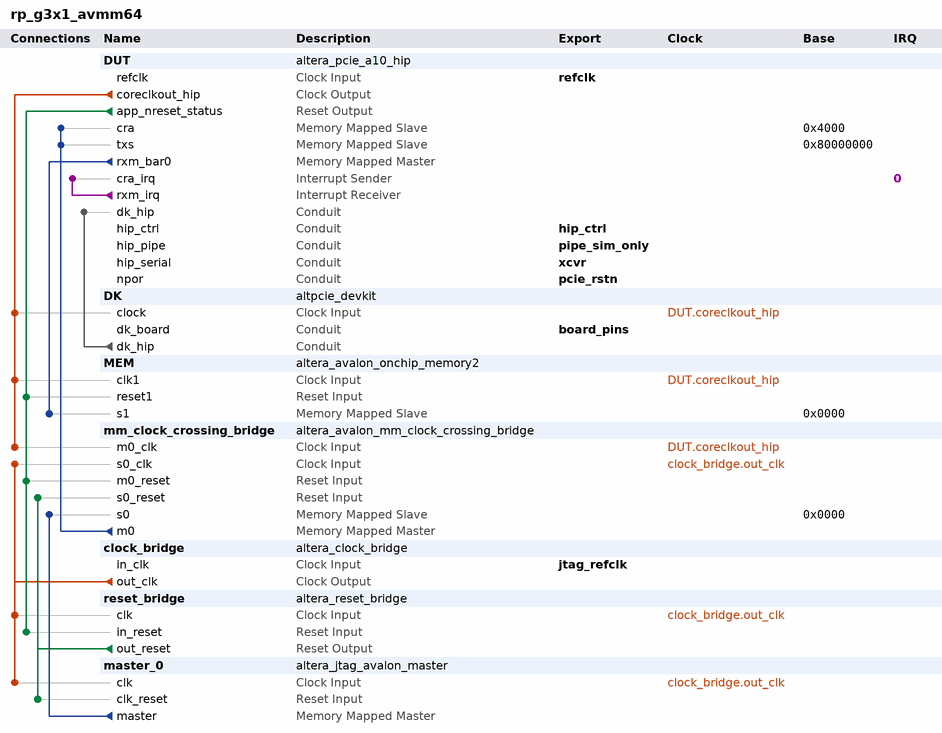
[diagram p0: system contents]
# Platform Designer (Qsys) system rp_g3x1_avmm64, Arria 10 10AX115S1F45I1SG
# Parameters at their usual value, and those the tool derives, are not listed.
package require -exact qsys 18.0
create_system rp_g3x1_avmm64
set_project_property DEVICE_FAMILY {Arria 10}
set_project_property DEVICE 10AX115S1F45I1SG

add_instance DUT altera_pcie_a10_hip 18.0
set_instance_parameter_value DUT adme_enable_hwtcl 0
set_instance_parameter_value DUT advance_error_reporting_hwtcl 0
set_instance_parameter_value DUT apps_type_hwtcl 15
set_instance_parameter_value DUT ari_support_hwtcl 0
set_instance_parameter_value DUT ast_trs_num_desc_hwtcl 16
set_instance_parameter_value DUT ast_trs_rxdata_width_hwtcl 256
set_instance_parameter_value DUT ast_trs_rxdesc_width_hwtcl 256
set_instance_parameter_value DUT ast_trs_rxmty_width_hwtcl 32
set_instance_parameter_value DUT ast_trs_txdata_width_hwtcl 256
set_instance_parameter_value DUT ast_trs_txdesc_width_hwtcl 256
set_instance_parameter_value DUT ast_trs_txmty_width_hwtcl 32
set_instance_parameter_value DUT ast_trs_txstatus_width_hwtcl 256
set_instance_parameter_value DUT avmm_addr_width_hwtcl 32
set_instance_parameter_value DUT bar0_address_width_hwtcl 16
set_instance_parameter_value DUT bar0_type_hwtcl {64-bit prefetchable memory}
set_instance_parameter_value DUT bar1_address_width_hwtcl 0
set_instance_parameter_value DUT bar1_type_hwtcl Disabled
set_instance_parameter_value DUT bar2_address_width_hwtcl 8
set_instance_parameter_value DUT bar2_type_hwtcl Disabled
set_instance_parameter_value DUT bar3_address_width_hwtcl 0
set_instance_parameter_value DUT bar3_type_hwtcl Disabled
set_instance_parameter_value DUT base_device NIGHTFURY5
set_instance_parameter_value DUT bfm_drive_interface_clk_hwtcl 1
set_instance_parameter_value DUT bfm_drive_interface_control_hwtcl 1
set_instance_parameter_value DUT bfm_drive_interface_npor_hwtcl 1
set_instance_parameter_value DUT bfm_drive_interface_pipe_hwtcl 1
set_instance_parameter_value DUT cg_a2p_addr_map_pass_thru_bits_hwtcl 24
set_instance_parameter_value DUT cg_enable_a2p_interrupt_hwtcl 0
set_instance_parameter_value DUT cg_enable_advanced_interrupt_hwtcl 0
set_instance_parameter_value DUT class_code_hwtcl 0
set_instance_parameter_value DUT completion_timeout_hwtcl NONE
set_instance_parameter_value DUT cseb_autonomous_hwtcl 0
set_instance_parameter_value DUT cseb_config_bypass_gui_hwtcl 0
set_instance_parameter_value DUT design_environment_hwtcl QSYS
set_instance_parameter_value DUT devhide_support_hwtcl 0
set_instance_parameter_value DUT device_embedded_ep_support_hwtcl 0
set_instance_parameter_value DUT device_id_hwtcl 57345
set_instance_parameter_value DUT dis_adapt 0
set_instance_parameter_value DUT dma_use_scfifo_ext_hwtcl 0
set_instance_parameter_value DUT ecrc_check_capable_hwtcl 0
set_instance_parameter_value DUT ecrc_gen_capable_hwtcl 0
set_instance_parameter_value DUT enable_alternate_link_list_hwtcl 0
set_instance_parameter_value DUT enable_ast_trs_hwtcl 0
set_instance_parameter_value DUT enable_avst_reset_hwtcl 0
set_instance_parameter_value DUT enable_custom_features_hwtcl 0
set_instance_parameter_value DUT enable_devkit_conduit_hwtcl 1
set_instance_parameter_value DUT enable_example_design_qii_hwtcl 1
set_instance_parameter_value DUT enable_example_design_sim_hwtcl 0
set_instance_parameter_value DUT enable_example_design_synth_hwtcl 0
set_instance_parameter_value DUT enable_example_design_tb_hwtcl 1
set_instance_parameter_value DUT enable_g3_bypass_equlz_rp_sim_hwtcl 1
set_instance_parameter_value DUT enable_gen3phase2eq_timechange 0
set_instance_parameter_value DUT enable_hip_status_for_avmm_hwtcl 0
set_instance_parameter_value DUT enable_lmi_hwtcl 0
set_instance_parameter_value DUT enable_nobar_slection_hwtcl 0
set_instance_parameter_value DUT enable_rxm_burst_hwtcl 0
set_instance_parameter_value DUT enable_skp_det 0
set_instance_parameter_value DUT enable_soft_dfe 0
set_instance_parameter_value DUT export_fpll_output_to_top_level_hwtcl 0
set_instance_parameter_value DUT export_phy_input_to_top_level_hwtcl 0
set_instance_parameter_value DUT extended_tag_support_hwtcl 0
set_instance_parameter_value DUT flr_capability_user_hwtcl 0
set_instance_parameter_value DUT force_tag_checking_on_hwtcl 0
set_instance_parameter_value DUT gen3_coeff_1_hwtcl 9
set_instance_parameter_value DUT gen3_coeff_3_ber_meas_hwtcl 12ms
set_instance_parameter_value DUT include_virtio_capabilities_hwtcl 0
set_instance_parameter_value DUT interface_type_hwtcl Avalon-MM
set_instance_parameter_value DUT internal_controller_hwtcl 1
set_instance_parameter_value DUT link2csr_width_hwtcl 16
set_instance_parameter_value DUT maximum_payload_size_hwtcl 256
set_instance_parameter_value DUT part_trait_device 10AX115S1F45I1SG
set_instance_parameter_value DUT pf0_ats_invalidate_queue_depth_hwtcl 0
set_instance_parameter_value DUT pf0_bar0_prefetchable_hwtcl 1
set_instance_parameter_value DUT pf0_bar0_present_hwtcl 1
set_instance_parameter_value DUT pf0_bar0_size_hwtcl 12
set_instance_parameter_value DUT pf0_bar0_type_hwtcl 1
set_instance_parameter_value DUT pf0_bar1_prefetchable_hwtcl 1
set_instance_parameter_value DUT pf0_bar1_present_hwtcl 0
set_instance_parameter_value DUT pf0_bar1_size_hwtcl 12
set_instance_parameter_value DUT pf0_bar2_prefetchable_hwtcl 1
set_instance_parameter_value DUT pf0_bar2_present_hwtcl 0
set_instance_parameter_value DUT pf0_bar2_size_hwtcl 12
set_instance_parameter_value DUT pf0_bar2_type_hwtcl 1
set_instance_parameter_value DUT pf0_bar3_prefetchable_hwtcl 1
set_instance_parameter_value DUT pf0_bar3_present_hwtcl 0
set_instance_parameter_value DUT pf0_bar3_size_hwtcl 12
set_instance_parameter_value DUT pf0_bar4_prefetchable_hwtcl 1
set_instance_parameter_value DUT pf0_bar4_present_hwtcl 0
set_instance_parameter_value DUT pf0_bar4_size_hwtcl 12
set_instance_parameter_value DUT pf0_bar4_type_hwtcl 1
set_instance_parameter_value DUT pf0_bar5_prefetchable_hwtcl 1
set_instance_parameter_value DUT pf0_bar5_present_hwtcl 0
set_instance_parameter_value DUT pf0_bar5_size_hwtcl 12
set_instance_parameter_value DUT pf0_exprom_bar_present_hwtcl 0
set_instance_parameter_value DUT pf0_exprom_bar_size_hwtcl 12
set_instance_parameter_value DUT pf0_extra_bar_present_hwtcl 0
set_instance_parameter_value DUT pf0_extra_bar_size_hwtcl 12
set_instance_parameter_value DUT pf0_interrupt_pin_hwtcl inta
set_instance_parameter_value DUT pf0_intr_line_hwtcl 0
set_instance_parameter_value DUT pf0_msi_multi_message_capable_hwtcl 4
set_instance_parameter_value DUT pf0_msix_pba_bir_hwtcl 0
set_instance_parameter_value DUT pf0_msix_pba_offset_hwtcl 0
set_instance_parameter_value DUT pf0_msix_table_bir_hwtcl 0
set_instance_parameter_value DUT pf0_msix_table_offset_hwtcl 0
set_instance_parameter_value DUT pf0_msix_table_size_hwtcl 0
set_instance_parameter_value DUT pf0_pci_prog_intfc_byte_hwtcl 0
set_instance_parameter_value DUT pf0_subclass_code_hwtcl 0
set_instance_parameter_value DUT pf0_tph_dev_specific_mode_support_hwtcl 0
set_instance_parameter_value DUT pf0_tph_int_mode_support_hwtcl 0
set_instance_parameter_value DUT pf0_tph_st_table_location_hwtcl 0
set_instance_parameter_value DUT pf0_tph_st_table_size_hwtcl 63
set_instance_parameter_value DUT pf0_vf_bar0_prefetchable_hwtcl 1
set_instance_parameter_value DUT pf0_vf_bar0_present_hwtcl 0
set_instance_parameter_value DUT pf0_vf_bar0_size_hwtcl 12
set_instance_parameter_value DUT pf0_vf_bar0_type_hwtcl 1
set_instance_parameter_value DUT pf0_vf_bar1_prefetchable_hwtcl 1
set_instance_parameter_value DUT pf0_vf_bar1_present_hwtcl 0
set_instance_parameter_value DUT pf0_vf_bar1_size_hwtcl 12
set_instance_parameter_value DUT pf0_vf_bar2_prefetchable_hwtcl 1
set_instance_parameter_value DUT pf0_vf_bar2_present_hwtcl 0
set_instance_parameter_value DUT pf0_vf_bar2_size_hwtcl 12
set_instance_parameter_value DUT pf0_vf_bar2_type_hwtcl 1
set_instance_parameter_value DUT pf0_vf_bar3_prefetchable_hwtcl 1
set_instance_parameter_value DUT pf0_vf_bar3_present_hwtcl 0
set_instance_parameter_value DUT pf0_vf_bar3_size_hwtcl 12
set_instance_parameter_value DUT pf0_vf_bar4_prefetchable_hwtcl 1
set_instance_parameter_value DUT pf0_vf_bar4_present_hwtcl 0
set_instance_parameter_value DUT pf0_vf_bar4_size_hwtcl 12
set_instance_parameter_value DUT pf0_vf_bar4_type_hwtcl 1
set_instance_parameter_value DUT pf0_vf_bar5_prefetchable_hwtcl 1
set_instance_parameter_value DUT pf0_vf_bar5_present_hwtcl 0
set_instance_parameter_value DUT pf0_vf_bar5_size_hwtcl 12
set_instance_parameter_value DUT pf0_vf_count_user_hwtcl 0
set_instance_parameter_value DUT pf0_vf_device_id_hwtcl 0
set_instance_parameter_value DUT pf0_vf_msix_pba_bir_hwtcl 0
set_instance_parameter_value DUT pf0_vf_msix_pba_offset_hwtcl 0
set_instance_parameter_value DUT pf0_vf_msix_tbl_bir_hwtcl 0
set_instance_parameter_value DUT pf0_vf_msix_tbl_offset_hwtcl 0
set_instance_parameter_value DUT pf0_vf_msix_tbl_size_hwtcl 0
set_instance_parameter_value DUT pf0_vf_tph_dev_specific_mode_support_hwtcl 0
set_instance_parameter_value DUT pf0_vf_tph_int_mode_support_hwtcl 0
set_instance_parameter_value DUT pf0_vf_tph_st_table_location_hwtcl 0
set_instance_parameter_value DUT pf0_vf_tph_st_table_size_hwtcl 63
set_instance_parameter_value DUT pf0_virtio_capability_present_hwtcl 0
set_instance_parameter_value DUT pf0_virtio_cmn_config_bar_indicator_hwtcl 0
set_instance_parameter_value DUT pf0_virtio_cmn_config_bar_offset_hwtcl 0
set_instance_parameter_value DUT pf0_virtio_cmn_config_structure_length_hwtcl 0
set_instance_parameter_value DUT pf0_virtio_device_specific_cap_present_hwtcl 0
set_instance_parameter_value DUT pf0_virtio_devspecific_bar_indicator_hwtcl 0
set_instance_parameter_value DUT pf0_virtio_devspecific_bar_offset_hwtcl 0
set_instance_parameter_value DUT pf0_virtio_devspecific_structure_length_hwtcl 0
set_instance_parameter_value DUT pf0_virtio_isrstatus_bar_indicator_hwtcl 0
set_instance_parameter_value DUT pf0_virtio_isrstatus_bar_offset_hwtcl 0
set_instance_parameter_value DUT pf0_virtio_isrstatus_structure_length_hwtcl 0
set_instance_parameter_value DUT pf0_virtio_notification_bar_indicator_hwtcl 0
set_instance_parameter_value DUT pf0_virtio_notification_bar_offset_hwtcl 0
set_instance_parameter_value DUT pf0_virtio_notification_structure_length_hwtcl 0
set_instance_parameter_value DUT pf0_virtio_notify_off_multiplier_hwtcl 0
set_instance_parameter_value DUT pf0_virtio_pciconfig_access_bar_indicator_hwtcl 0
set_instance_parameter_value DUT pf0_virtio_pciconfig_access_bar_offset_hwtcl 0
set_instance_parameter_value DUT pf0_virtio_pciconfig_access_structure_length_hwtcl 0
set_instance_parameter_value DUT pf1_ats_invalidate_queue_depth_hwtcl 0
set_instance_parameter_value DUT pf1_bar0_prefetchable_hwtcl 1
set_instance_parameter_value DUT pf1_bar0_present_hwtcl 0
set_instance_parameter_value DUT pf1_bar0_size_hwtcl 12
set_instance_parameter_value DUT pf1_bar0_type_hwtcl 1
set_instance_parameter_value DUT pf1_bar1_prefetchable_hwtcl 1
set_instance_parameter_value DUT pf1_bar1_present_hwtcl 0
set_instance_parameter_value DUT pf1_bar1_size_hwtcl 12
set_instance_parameter_value DUT pf1_bar2_prefetchable_hwtcl 1
set_instance_parameter_value DUT pf1_bar2_present_hwtcl 0
set_instance_parameter_value DUT pf1_bar2_size_hwtcl 12
set_instance_parameter_value DUT pf1_bar2_type_hwtcl 1
set_instance_parameter_value DUT pf1_bar3_prefetchable_hwtcl 1
set_instance_parameter_value DUT pf1_bar3_present_hwtcl 0
set_instance_parameter_value DUT pf1_bar3_size_hwtcl 12
set_instance_parameter_value DUT pf1_bar4_prefetchable_hwtcl 1
set_instance_parameter_value DUT pf1_bar4_present_hwtcl 0
set_instance_parameter_value DUT pf1_bar4_size_hwtcl 12
set_instance_parameter_value DUT pf1_bar4_type_hwtcl 1
set_instance_parameter_value DUT pf1_bar5_prefetchable_hwtcl 1
set_instance_parameter_value DUT pf1_bar5_present_hwtcl 0
set_instance_parameter_value DUT pf1_bar5_size_hwtcl 12
set_instance_parameter_value DUT pf1_class_code_hwtcl 0
set_instance_parameter_value DUT pf1_device_id_hwtcl 0
set_instance_parameter_value DUT pf1_exprom_bar_present_hwtcl 0
set_instance_parameter_value DUT pf1_exprom_bar_size_hwtcl 12
set_instance_parameter_value DUT pf1_interrupt_pin_hwtcl inta
set_instance_parameter_value DUT pf1_intr_line_hwtcl 0
set_instance_parameter_value DUT pf1_msi_multi_message_capable_hwtcl 4
set_instance_parameter_value DUT pf1_msix_pba_bir_hwtcl 0
set_instance_parameter_value DUT pf1_msix_pba_offset_hwtcl 0
set_instance_parameter_value DUT pf1_msix_table_bir_hwtcl 0
set_instance_parameter_value DUT pf1_msix_table_offset_hwtcl 0
set_instance_parameter_value DUT pf1_msix_table_size_hwtcl 0
set_instance_parameter_value DUT pf1_pci_prog_intfc_byte_hwtcl 0
set_instance_parameter_value DUT pf1_revision_id_hwtcl 0
set_instance_parameter_value DUT pf1_subclass_code_hwtcl 0
set_instance_parameter_value DUT pf1_subsystem_device_id_hwtcl 0
set_instance_parameter_value DUT pf1_subsystem_vendor_id_hwtcl 0
set_instance_parameter_value DUT pf1_tph_dev_specific_mode_support_hwtcl 0
set_instance_parameter_value DUT pf1_tph_int_mode_support_hwtcl 0
set_instance_parameter_value DUT pf1_tph_st_table_location_hwtcl 0
set_instance_parameter_value DUT pf1_tph_st_table_size_hwtcl 63
set_instance_parameter_value DUT pf1_vendor_id_hwtcl 0
set_instance_parameter_value DUT pf1_vf_bar0_prefetchable_hwtcl 1
set_instance_parameter_value DUT pf1_vf_bar0_present_hwtcl 0
set_instance_parameter_value DUT pf1_vf_bar0_size_hwtcl 12
set_instance_parameter_value DUT pf1_vf_bar0_type_hwtcl 1
set_instance_parameter_value DUT pf1_vf_bar1_prefetchable_hwtcl 1
set_instance_parameter_value DUT pf1_vf_bar1_present_hwtcl 0
set_instance_parameter_value DUT pf1_vf_bar1_size_hwtcl 12
set_instance_parameter_value DUT pf1_vf_bar2_prefetchable_hwtcl 1
set_instance_parameter_value DUT pf1_vf_bar2_present_hwtcl 0
set_instance_parameter_value DUT pf1_vf_bar2_size_hwtcl 12
set_instance_parameter_value DUT pf1_vf_bar2_type_hwtcl 1
set_instance_parameter_value DUT pf1_vf_bar3_prefetchable_hwtcl 1
set_instance_parameter_value DUT pf1_vf_bar3_present_hwtcl 0
set_instance_parameter_value DUT pf1_vf_bar3_size_hwtcl 12
set_instance_parameter_value DUT pf1_vf_bar4_prefetchable_hwtcl 1
set_instance_parameter_value DUT pf1_vf_bar4_present_hwtcl 0
set_instance_parameter_value DUT pf1_vf_bar4_size_hwtcl 12
set_instance_parameter_value DUT pf1_vf_bar4_type_hwtcl 1
set_instance_parameter_value DUT pf1_vf_bar5_prefetchable_hwtcl 1
set_instance_parameter_value DUT pf1_vf_bar5_present_hwtcl 0
set_instance_parameter_value DUT pf1_vf_bar5_size_hwtcl 12
set_instance_parameter_value DUT pf1_vf_count_user_hwtcl 0
set_instance_parameter_value DUT pf1_vf_device_id_hwtcl 0
set_instance_parameter_value DUT pf1_vf_msix_pba_bir_hwtcl 0
set_instance_parameter_value DUT pf1_vf_msix_pba_offset_hwtcl 0
set_instance_parameter_value DUT pf1_vf_msix_tbl_bir_hwtcl 0
set_instance_parameter_value DUT pf1_vf_msix_tbl_offset_hwtcl 0
set_instance_parameter_value DUT pf1_vf_msix_tbl_size_hwtcl 0
set_instance_parameter_value DUT pf1_vf_tph_dev_specific_mode_support_hwtcl 0
set_instance_parameter_value DUT pf1_vf_tph_int_mode_support_hwtcl 0
set_instance_parameter_value DUT pf1_vf_tph_st_table_location_hwtcl 0
set_instance_parameter_value DUT pf1_vf_tph_st_table_size_hwtcl 63
set_instance_parameter_value DUT pf1_virtio_capability_present_hwtcl 0
set_instance_parameter_value DUT pf1_virtio_cmn_config_bar_indicator_hwtcl 0
set_instance_parameter_value DUT pf1_virtio_cmn_config_bar_offset_hwtcl 0
set_instance_parameter_value DUT pf1_virtio_cmn_config_structure_length_hwtcl 0
set_instance_parameter_value DUT pf1_virtio_device_specific_cap_present_hwtcl 0
set_instance_parameter_value DUT pf1_virtio_devspecific_bar_indicator_hwtcl 0
set_instance_parameter_value DUT pf1_virtio_devspecific_bar_offset_hwtcl 0
set_instance_parameter_value DUT pf1_virtio_devspecific_structure_length_hwtcl 0
set_instance_parameter_value DUT pf1_virtio_isrstatus_bar_indicator_hwtcl 0
set_instance_parameter_value DUT pf1_virtio_isrstatus_bar_offset_hwtcl 0
set_instance_parameter_value DUT pf1_virtio_isrstatus_structure_length_hwtcl 0
set_instance_parameter_value DUT pf1_virtio_notification_bar_indicator_hwtcl 0
set_instance_parameter_value DUT pf1_virtio_notification_bar_offset_hwtcl 0
set_instance_parameter_value DUT pf1_virtio_notification_structure_length_hwtcl 0
set_instance_parameter_value DUT pf1_virtio_notify_off_multiplier_hwtcl 0
set_instance_parameter_value DUT pf1_virtio_pciconfig_access_bar_indicator_hwtcl 0
set_instance_parameter_value DUT pf1_virtio_pciconfig_access_bar_offset_hwtcl 0
set_instance_parameter_value DUT pf1_virtio_pciconfig_access_structure_length_hwtcl 0
set_instance_parameter_value DUT pf2_ats_invalidate_queue_depth_hwtcl 0
set_instance_parameter_value DUT pf2_bar0_prefetchable_hwtcl 1
set_instance_parameter_value DUT pf2_bar0_present_hwtcl 0
set_instance_parameter_value DUT pf2_bar0_size_hwtcl 12
set_instance_parameter_value DUT pf2_bar0_type_hwtcl 1
set_instance_parameter_value DUT pf2_bar1_prefetchable_hwtcl 1
set_instance_parameter_value DUT pf2_bar1_present_hwtcl 0
set_instance_parameter_value DUT pf2_bar1_size_hwtcl 12
set_instance_parameter_value DUT pf2_bar2_prefetchable_hwtcl 1
set_instance_parameter_value DUT pf2_bar2_present_hwtcl 0
set_instance_parameter_value DUT pf2_bar2_size_hwtcl 12
set_instance_parameter_value DUT pf2_bar2_type_hwtcl 1
set_instance_parameter_value DUT pf2_bar3_prefetchable_hwtcl 1
set_instance_parameter_value DUT pf2_bar3_present_hwtcl 0
set_instance_parameter_value DUT pf2_bar3_size_hwtcl 12
set_instance_parameter_value DUT pf2_bar4_prefetchable_hwtcl 1
set_instance_parameter_value DUT pf2_bar4_present_hwtcl 0
set_instance_parameter_value DUT pf2_bar4_size_hwtcl 12
set_instance_parameter_value DUT pf2_bar4_type_hwtcl 1
set_instance_parameter_value DUT pf2_bar5_prefetchable_hwtcl 1
set_instance_parameter_value DUT pf2_bar5_present_hwtcl 0
set_instance_parameter_value DUT pf2_bar5_size_hwtcl 12
set_instance_parameter_value DUT pf2_class_code_hwtcl 0
set_instance_parameter_value DUT pf2_device_id_hwtcl 0
set_instance_parameter_value DUT pf2_exprom_bar_present_hwtcl 0
set_instance_parameter_value DUT pf2_exprom_bar_size_hwtcl 12
set_instance_parameter_value DUT pf2_interrupt_pin_hwtcl inta
set_instance_parameter_value DUT pf2_intr_line_hwtcl 0
set_instance_parameter_value DUT pf2_msi_multi_message_capable_hwtcl 4
set_instance_parameter_value DUT pf2_msix_pba_bir_hwtcl 0
set_instance_parameter_value DUT pf2_msix_pba_offset_hwtcl 0
set_instance_parameter_value DUT pf2_msix_table_bir_hwtcl 0
set_instance_parameter_value DUT pf2_msix_table_offset_hwtcl 0
set_instance_parameter_value DUT pf2_msix_table_size_hwtcl 0
set_instance_parameter_value DUT pf2_pci_prog_intfc_byte_hwtcl 0
set_instance_parameter_value DUT pf2_revision_id_hwtcl 0
set_instance_parameter_value DUT pf2_subclass_code_hwtcl 0
set_instance_parameter_value DUT pf2_subsystem_device_id_hwtcl 0
set_instance_parameter_value DUT pf2_subsystem_vendor_id_hwtcl 0
set_instance_parameter_value DUT pf2_tph_dev_specific_mode_support_hwtcl 0
set_instance_parameter_value DUT pf2_tph_int_mode_support_hwtcl 0
set_instance_parameter_value DUT pf2_tph_st_table_location_hwtcl 0
set_instance_parameter_value DUT pf2_tph_st_table_size_hwtcl 63
set_instance_parameter_value DUT pf2_vendor_id_hwtcl 0
set_instance_parameter_value DUT pf2_vf_bar0_prefetchable_hwtcl 1
set_instance_parameter_value DUT pf2_vf_bar0_present_hwtcl 0
set_instance_parameter_value DUT pf2_vf_bar0_size_hwtcl 12
set_instance_parameter_value DUT pf2_vf_bar0_type_hwtcl 1
set_instance_parameter_value DUT pf2_vf_bar1_prefetchable_hwtcl 1
set_instance_parameter_value DUT pf2_vf_bar1_present_hwtcl 0
set_instance_parameter_value DUT pf2_vf_bar1_size_hwtcl 12
set_instance_parameter_value DUT pf2_vf_bar2_prefetchable_hwtcl 1
set_instance_parameter_value DUT pf2_vf_bar2_present_hwtcl 0
set_instance_parameter_value DUT pf2_vf_bar2_size_hwtcl 12
set_instance_parameter_value DUT pf2_vf_bar2_type_hwtcl 1
set_instance_parameter_value DUT pf2_vf_bar3_prefetchable_hwtcl 1
set_instance_parameter_value DUT pf2_vf_bar3_present_hwtcl 0
set_instance_parameter_value DUT pf2_vf_bar3_size_hwtcl 12
set_instance_parameter_value DUT pf2_vf_bar4_prefetchable_hwtcl 1
set_instance_parameter_value DUT pf2_vf_bar4_present_hwtcl 0
set_instance_parameter_value DUT pf2_vf_bar4_size_hwtcl 12
set_instance_parameter_value DUT pf2_vf_bar4_type_hwtcl 1
set_instance_parameter_value DUT pf2_vf_bar5_prefetchable_hwtcl 1
set_instance_parameter_value DUT pf2_vf_bar5_present_hwtcl 0
set_instance_parameter_value DUT pf2_vf_bar5_size_hwtcl 12
set_instance_parameter_value DUT pf2_vf_count_user_hwtcl 0
set_instance_parameter_value DUT pf2_vf_device_id_hwtcl 0
set_instance_parameter_value DUT pf2_vf_msix_pba_bir_hwtcl 0
set_instance_parameter_value DUT pf2_vf_msix_pba_offset_hwtcl 0
set_instance_parameter_value DUT pf2_vf_msix_tbl_bir_hwtcl 0
set_instance_parameter_value DUT pf2_vf_msix_tbl_offset_hwtcl 0
set_instance_parameter_value DUT pf2_vf_msix_tbl_size_hwtcl 0
set_instance_parameter_value DUT pf2_vf_tph_dev_specific_mode_support_hwtcl 0
set_instance_parameter_value DUT pf2_vf_tph_int_mode_support_hwtcl 0
set_instance_parameter_value DUT pf2_vf_tph_st_table_location_hwtcl 0
set_instance_parameter_value DUT pf2_vf_tph_st_table_size_hwtcl 63
set_instance_parameter_value DUT pf2_virtio_capability_present_hwtcl 0
set_instance_parameter_value DUT pf2_virtio_cmn_config_bar_indicator_hwtcl 0
set_instance_parameter_value DUT pf2_virtio_cmn_config_bar_offset_hwtcl 0
set_instance_parameter_value DUT pf2_virtio_cmn_config_structure_length_hwtcl 0
set_instance_parameter_value DUT pf2_virtio_device_specific_cap_present_hwtcl 0
set_instance_parameter_value DUT pf2_virtio_devspecific_bar_indicator_hwtcl 0
set_instance_parameter_value DUT pf2_virtio_devspecific_bar_offset_hwtcl 0
set_instance_parameter_value DUT pf2_virtio_devspecific_structure_length_hwtcl 0
set_instance_parameter_value DUT pf2_virtio_isrstatus_bar_indicator_hwtcl 0
set_instance_parameter_value DUT pf2_virtio_isrstatus_bar_offset_hwtcl 0
set_instance_parameter_value DUT pf2_virtio_isrstatus_structure_length_hwtcl 0
set_instance_parameter_value DUT pf2_virtio_notification_bar_indicator_hwtcl 0
set_instance_parameter_value DUT pf2_virtio_notification_bar_offset_hwtcl 0
set_instance_parameter_value DUT pf2_virtio_notification_structure_length_hwtcl 0
set_instance_parameter_value DUT pf2_virtio_notify_off_multiplier_hwtcl 0
set_instance_parameter_value DUT pf2_virtio_pciconfig_access_bar_indicator_hwtcl 0
set_instance_parameter_value DUT pf2_virtio_pciconfig_access_bar_offset_hwtcl 0
set_instance_parameter_value DUT pf2_virtio_pciconfig_access_structure_length_hwtcl 0
set_instance_parameter_value DUT pf3_ats_invalidate_queue_depth_hwtcl 0
set_instance_parameter_value DUT pf3_bar0_prefetchable_hwtcl 1
set_instance_parameter_value DUT pf3_bar0_present_hwtcl 0
set_instance_parameter_value DUT pf3_bar0_size_hwtcl 12
set_instance_parameter_value DUT pf3_bar0_type_hwtcl 1
set_instance_parameter_value DUT pf3_bar1_prefetchable_hwtcl 1
set_instance_parameter_value DUT pf3_bar1_present_hwtcl 0
set_instance_parameter_value DUT pf3_bar1_size_hwtcl 12
set_instance_parameter_value DUT pf3_bar2_prefetchable_hwtcl 1
set_instance_parameter_value DUT pf3_bar2_present_hwtcl 0
set_instance_parameter_value DUT pf3_bar2_size_hwtcl 12
set_instance_parameter_value DUT pf3_bar2_type_hwtcl 1
set_instance_parameter_value DUT pf3_bar3_prefetchable_hwtcl 1
set_instance_parameter_value DUT pf3_bar3_present_hwtcl 0
set_instance_parameter_value DUT pf3_bar3_size_hwtcl 12
set_instance_parameter_value DUT pf3_bar4_prefetchable_hwtcl 1
set_instance_parameter_value DUT pf3_bar4_present_hwtcl 0
set_instance_parameter_value DUT pf3_bar4_size_hwtcl 12
set_instance_parameter_value DUT pf3_bar4_type_hwtcl 1
set_instance_parameter_value DUT pf3_bar5_prefetchable_hwtcl 1
set_instance_parameter_value DUT pf3_bar5_present_hwtcl 0
set_instance_parameter_value DUT pf3_bar5_size_hwtcl 12
set_instance_parameter_value DUT pf3_class_code_hwtcl 0
set_instance_parameter_value DUT pf3_device_id_hwtcl 0
set_instance_parameter_value DUT pf3_exprom_bar_present_hwtcl 0
set_instance_parameter_value DUT pf3_exprom_bar_size_hwtcl 12
set_instance_parameter_value DUT pf3_interrupt_pin_hwtcl inta
set_instance_parameter_value DUT pf3_intr_line_hwtcl 0
set_instance_parameter_value DUT pf3_msi_multi_message_capable_hwtcl 4
set_instance_parameter_value DUT pf3_msix_pba_bir_hwtcl 0
set_instance_parameter_value DUT pf3_msix_pba_offset_hwtcl 0
set_instance_parameter_value DUT pf3_msix_table_bir_hwtcl 0
set_instance_parameter_value DUT pf3_msix_table_offset_hwtcl 0
set_instance_parameter_value DUT pf3_msix_table_size_hwtcl 0
set_instance_parameter_value DUT pf3_pci_prog_intfc_byte_hwtcl 0
set_instance_parameter_value DUT pf3_revision_id_hwtcl 0
set_instance_parameter_value DUT pf3_subclass_code_hwtcl 0
set_instance_parameter_value DUT pf3_subsystem_device_id_hwtcl 0
set_instance_parameter_value DUT pf3_subsystem_vendor_id_hwtcl 0
set_instance_parameter_value DUT pf3_tph_dev_specific_mode_support_hwtcl 0
set_instance_parameter_value DUT pf3_tph_int_mode_support_hwtcl 0
set_instance_parameter_value DUT pf3_tph_st_table_location_hwtcl 0
set_instance_parameter_value DUT pf3_tph_st_table_size_hwtcl 63
set_instance_parameter_value DUT pf3_vendor_id_hwtcl 0
set_instance_parameter_value DUT pf3_vf_bar0_prefetchable_hwtcl 1
set_instance_parameter_value DUT pf3_vf_bar0_present_hwtcl 0
set_instance_parameter_value DUT pf3_vf_bar0_size_hwtcl 12
set_instance_parameter_value DUT pf3_vf_bar0_type_hwtcl 1
set_instance_parameter_value DUT pf3_vf_bar1_prefetchable_hwtcl 1
set_instance_parameter_value DUT pf3_vf_bar1_present_hwtcl 0
set_instance_parameter_value DUT pf3_vf_bar1_size_hwtcl 12
set_instance_parameter_value DUT pf3_vf_bar2_prefetchable_hwtcl 1
set_instance_parameter_value DUT pf3_vf_bar2_present_hwtcl 0
set_instance_parameter_value DUT pf3_vf_bar2_size_hwtcl 12
set_instance_parameter_value DUT pf3_vf_bar2_type_hwtcl 1
set_instance_parameter_value DUT pf3_vf_bar3_prefetchable_hwtcl 1
set_instance_parameter_value DUT pf3_vf_bar3_present_hwtcl 0
set_instance_parameter_value DUT pf3_vf_bar3_size_hwtcl 12
set_instance_parameter_value DUT pf3_vf_bar4_prefetchable_hwtcl 1
set_instance_parameter_value DUT pf3_vf_bar4_present_hwtcl 0
set_instance_parameter_value DUT pf3_vf_bar4_size_hwtcl 12
set_instance_parameter_value DUT pf3_vf_bar4_type_hwtcl 1
set_instance_parameter_value DUT pf3_vf_bar5_prefetchable_hwtcl 1
set_instance_parameter_value DUT pf3_vf_bar5_present_hwtcl 0
set_instance_parameter_value DUT pf3_vf_bar5_size_hwtcl 12
set_instance_parameter_value DUT pf3_vf_count_user_hwtcl 0
set_instance_parameter_value DUT pf3_vf_device_id_hwtcl 0
set_instance_parameter_value DUT pf3_vf_msix_pba_bir_hwtcl 0
set_instance_parameter_value DUT pf3_vf_msix_pba_offset_hwtcl 0
set_instance_parameter_value DUT pf3_vf_msix_tbl_bir_hwtcl 0
set_instance_parameter_value DUT pf3_vf_msix_tbl_offset_hwtcl 0
set_instance_parameter_value DUT pf3_vf_msix_tbl_size_hwtcl 0
set_instance_parameter_value DUT pf3_vf_tph_dev_specific_mode_support_hwtcl 0
set_instance_parameter_value DUT pf3_vf_tph_int_mode_support_hwtcl 0
set_instance_parameter_value DUT pf3_vf_tph_st_table_location_hwtcl 0
set_instance_parameter_value DUT pf3_vf_tph_st_table_size_hwtcl 63
set_instance_parameter_value DUT pf3_virtio_capability_present_hwtcl 0
set_instance_parameter_value DUT pf3_virtio_cmn_config_bar_indicator_hwtcl 0
set_instance_parameter_value DUT pf3_virtio_cmn_config_bar_offset_hwtcl 0
set_instance_parameter_value DUT pf3_virtio_cmn_config_structure_length_hwtcl 0
set_instance_parameter_value DUT pf3_virtio_device_specific_cap_present_hwtcl 0
set_instance_parameter_value DUT pf3_virtio_devspecific_bar_indicator_hwtcl 0
set_instance_parameter_value DUT pf3_virtio_devspecific_bar_offset_hwtcl 0
set_instance_parameter_value DUT pf3_virtio_devspecific_structure_length_hwtcl 0
set_instance_parameter_value DUT pf3_virtio_isrstatus_bar_indicator_hwtcl 0
set_instance_parameter_value DUT pf3_virtio_isrstatus_bar_offset_hwtcl 0
set_instance_parameter_value DUT pf3_virtio_isrstatus_structure_length_hwtcl 0
set_instance_parameter_value DUT pf3_virtio_notification_bar_indicator_hwtcl 0
set_instance_parameter_value DUT pf3_virtio_notification_bar_offset_hwtcl 0
set_instance_parameter_value DUT pf3_virtio_notification_structure_length_hwtcl 0
set_instance_parameter_value DUT pf3_virtio_notify_off_multiplier_hwtcl 0
set_instance_parameter_value DUT pf3_virtio_pciconfig_access_bar_indicator_hwtcl 0
set_instance_parameter_value DUT pf3_virtio_pciconfig_access_bar_offset_hwtcl 0
set_instance_parameter_value DUT pf3_virtio_pciconfig_access_structure_length_hwtcl 0
set_instance_parameter_value DUT pf4_bar0_prefetchable_hwtcl 1
set_instance_parameter_value DUT pf4_bar0_present_hwtcl 0
set_instance_parameter_value DUT pf4_bar0_size_hwtcl 12
set_instance_parameter_value DUT pf4_bar0_type_hwtcl 1
set_instance_parameter_value DUT pf4_bar1_prefetchable_hwtcl 1
set_instance_parameter_value DUT pf4_bar1_present_hwtcl 0
set_instance_parameter_value DUT pf4_bar1_size_hwtcl 12
set_instance_parameter_value DUT pf4_bar2_prefetchable_hwtcl 1
set_instance_parameter_value DUT pf4_bar2_present_hwtcl 0
set_instance_parameter_value DUT pf4_bar2_size_hwtcl 12
set_instance_parameter_value DUT pf4_bar2_type_hwtcl 1
set_instance_parameter_value DUT pf4_bar3_prefetchable_hwtcl 1
set_instance_parameter_value DUT pf4_bar3_present_hwtcl 0
set_instance_parameter_value DUT pf4_bar3_size_hwtcl 12
set_instance_parameter_value DUT pf4_bar4_prefetchable_hwtcl 1
set_instance_parameter_value DUT pf4_bar4_present_hwtcl 0
set_instance_parameter_value DUT pf4_bar4_size_hwtcl 12
set_instance_parameter_value DUT pf4_bar4_type_hwtcl 1
set_instance_parameter_value DUT pf4_bar5_prefetchable_hwtcl 1
set_instance_parameter_value DUT pf4_bar5_present_hwtcl 0
set_instance_parameter_value DUT pf4_bar5_size_hwtcl 12
set_instance_parameter_value DUT pf4_class_code_hwtcl 0
set_instance_parameter_value DUT pf4_device_id_hwtcl 0
set_instance_parameter_value DUT pf4_exprom_bar_present_hwtcl 0
set_instance_parameter_value DUT pf4_exprom_bar_size_hwtcl 12
set_instance_parameter_value DUT pf4_interrupt_pin_hwtcl inta
set_instance_parameter_value DUT pf4_intr_line_hwtcl 0
set_instance_parameter_value DUT pf4_msi_multi_message_capable_hwtcl 4
set_instance_parameter_value DUT pf4_msix_pba_bir_hwtcl 0
set_instance_parameter_value DUT pf4_msix_pba_offset_hwtcl 0
set_instance_parameter_value DUT pf4_msix_table_bir_hwtcl 0
set_instance_parameter_value DUT pf4_msix_table_offset_hwtcl 0
set_instance_parameter_value DUT pf4_msix_table_size_hwtcl 0
set_instance_parameter_value DUT pf4_pci_prog_intfc_byte_hwtcl 0
set_instance_parameter_value DUT pf4_revision_id_hwtcl 0
set_instance_parameter_value DUT pf4_subclass_code_hwtcl 0
set_instance_parameter_value DUT pf4_subsystem_device_id_hwtcl 0
set_instance_parameter_value DUT pf4_subsystem_vendor_id_hwtcl 0
set_instance_parameter_value DUT pf4_vendor_id_hwtcl 0
set_instance_parameter_value DUT pf4_vf_device_id_hwtcl 0
set_instance_parameter_value DUT pf4_virtio_capability_present_hwtcl 0
set_instance_parameter_value DUT pf4_virtio_cmn_config_bar_indicator_hwtcl 0
set_instance_parameter_value DUT pf4_virtio_cmn_config_bar_offset_hwtcl 0
set_instance_parameter_value DUT pf4_virtio_cmn_config_structure_length_hwtcl 0
set_instance_parameter_value DUT pf4_virtio_device_specific_cap_present_hwtcl 0
set_instance_parameter_value DUT pf4_virtio_devspecific_bar_indicator_hwtcl 0
set_instance_parameter_value DUT pf4_virtio_devspecific_bar_offset_hwtcl 0
set_instance_parameter_value DUT pf4_virtio_devspecific_structure_length_hwtcl 0
set_instance_parameter_value DUT pf4_virtio_isrstatus_bar_indicator_hwtcl 0
set_instance_parameter_value DUT pf4_virtio_isrstatus_bar_offset_hwtcl 0
set_instance_parameter_value DUT pf4_virtio_isrstatus_structure_length_hwtcl 0
set_instance_parameter_value DUT pf4_virtio_notification_bar_indicator_hwtcl 0
set_instance_parameter_value DUT pf4_virtio_notification_bar_offset_hwtcl 0
set_instance_parameter_value DUT pf4_virtio_notification_structure_length_hwtcl 0
set_instance_parameter_value DUT pf4_virtio_notify_off_multiplier_hwtcl 0
set_instance_parameter_value DUT pf4_virtio_pciconfig_access_bar_indicator_hwtcl 0
set_instance_parameter_value DUT pf4_virtio_pciconfig_access_bar_offset_hwtcl 0
set_instance_parameter_value DUT pf4_virtio_pciconfig_access_structure_length_hwtcl 0
set_instance_parameter_value DUT pf5_bar0_prefetchable_hwtcl 1
set_instance_parameter_value DUT pf5_bar0_present_hwtcl 0
set_instance_parameter_value DUT pf5_bar0_size_hwtcl 12
set_instance_parameter_value DUT pf5_bar0_type_hwtcl 1
set_instance_parameter_value DUT pf5_bar1_prefetchable_hwtcl 1
set_instance_parameter_value DUT pf5_bar1_present_hwtcl 0
set_instance_parameter_value DUT pf5_bar1_size_hwtcl 12
set_instance_parameter_value DUT pf5_bar2_prefetchable_hwtcl 1
set_instance_parameter_value DUT pf5_bar2_present_hwtcl 0
set_instance_parameter_value DUT pf5_bar2_size_hwtcl 12
set_instance_parameter_value DUT pf5_bar2_type_hwtcl 1
set_instance_parameter_value DUT pf5_bar3_prefetchable_hwtcl 1
set_instance_parameter_value DUT pf5_bar3_present_hwtcl 0
set_instance_parameter_value DUT pf5_bar3_size_hwtcl 12
set_instance_parameter_value DUT pf5_bar4_prefetchable_hwtcl 1
set_instance_parameter_value DUT pf5_bar4_present_hwtcl 0
set_instance_parameter_value DUT pf5_bar4_size_hwtcl 12
set_instance_parameter_value DUT pf5_bar4_type_hwtcl 1
set_instance_parameter_value DUT pf5_bar5_prefetchable_hwtcl 1
set_instance_parameter_value DUT pf5_bar5_present_hwtcl 0
set_instance_parameter_value DUT pf5_bar5_size_hwtcl 12
set_instance_parameter_value DUT pf5_class_code_hwtcl 0
set_instance_parameter_value DUT pf5_device_id_hwtcl 0
set_instance_parameter_value DUT pf5_exprom_bar_present_hwtcl 0
set_instance_parameter_value DUT pf5_exprom_bar_size_hwtcl 12
set_instance_parameter_value DUT pf5_interrupt_pin_hwtcl inta
set_instance_parameter_value DUT pf5_intr_line_hwtcl 0
set_instance_parameter_value DUT pf5_msi_multi_message_capable_hwtcl 4
set_instance_parameter_value DUT pf5_msix_pba_bir_hwtcl 0
set_instance_parameter_value DUT pf5_msix_pba_offset_hwtcl 0
set_instance_parameter_value DUT pf5_msix_table_bir_hwtcl 0
set_instance_parameter_value DUT pf5_msix_table_offset_hwtcl 0
set_instance_parameter_value DUT pf5_msix_table_size_hwtcl 0
set_instance_parameter_value DUT pf5_pci_prog_intfc_byte_hwtcl 0
set_instance_parameter_value DUT pf5_revision_id_hwtcl 0
set_instance_parameter_value DUT pf5_subclass_code_hwtcl 0
set_instance_parameter_value DUT pf5_subsystem_device_id_hwtcl 0
set_instance_parameter_value DUT pf5_subsystem_vendor_id_hwtcl 0
set_instance_parameter_value DUT pf5_vendor_id_hwtcl 0
set_instance_parameter_value DUT pf5_vf_device_id_hwtcl 0
set_instance_parameter_value DUT pf5_virtio_capability_present_hwtcl 0
set_instance_parameter_value DUT pf5_virtio_cmn_config_bar_indicator_hwtcl 0
set_instance_parameter_value DUT pf5_virtio_cmn_config_bar_offset_hwtcl 0
set_instance_parameter_value DUT pf5_virtio_cmn_config_structure_length_hwtcl 0
set_instance_parameter_value DUT pf5_virtio_device_specific_cap_present_hwtcl 0
set_instance_parameter_value DUT pf5_virtio_devspecific_bar_indicator_hwtcl 0
set_instance_parameter_value DUT pf5_virtio_devspecific_bar_offset_hwtcl 0
set_instance_parameter_value DUT pf5_virtio_devspecific_structure_length_hwtcl 0
set_instance_parameter_value DUT pf5_virtio_isrstatus_bar_indicator_hwtcl 0
set_instance_parameter_value DUT pf5_virtio_isrstatus_bar_offset_hwtcl 0
set_instance_parameter_value DUT pf5_virtio_isrstatus_structure_length_hwtcl 0
set_instance_parameter_value DUT pf5_virtio_notification_bar_indicator_hwtcl 0
set_instance_parameter_value DUT pf5_virtio_notification_bar_offset_hwtcl 0
set_instance_parameter_value DUT pf5_virtio_notification_structure_length_hwtcl 0
set_instance_parameter_value DUT pf5_virtio_notify_off_multiplier_hwtcl 0
set_instance_parameter_value DUT pf5_virtio_pciconfig_access_bar_indicator_hwtcl 0
set_instance_parameter_value DUT pf5_virtio_pciconfig_access_bar_offset_hwtcl 0
set_instance_parameter_value DUT pf5_virtio_pciconfig_access_structure_length_hwtcl 0
set_instance_parameter_value DUT pf6_bar0_prefetchable_hwtcl 1
set_instance_parameter_value DUT pf6_bar0_present_hwtcl 0
set_instance_parameter_value DUT pf6_bar0_size_hwtcl 12
set_instance_parameter_value DUT pf6_bar0_type_hwtcl 1
set_instance_parameter_value DUT pf6_bar1_prefetchable_hwtcl 1
set_instance_parameter_value DUT pf6_bar1_present_hwtcl 0
set_instance_parameter_value DUT pf6_bar1_size_hwtcl 12
set_instance_parameter_value DUT pf6_bar2_prefetchable_hwtcl 1
set_instance_parameter_value DUT pf6_bar2_present_hwtcl 0
set_instance_parameter_value DUT pf6_bar2_size_hwtcl 12
set_instance_parameter_value DUT pf6_bar2_type_hwtcl 1
set_instance_parameter_value DUT pf6_bar3_prefetchable_hwtcl 1
set_instance_parameter_value DUT pf6_bar3_present_hwtcl 0
set_instance_parameter_value DUT pf6_bar3_size_hwtcl 12
set_instance_parameter_value DUT pf6_bar4_prefetchable_hwtcl 1
set_instance_parameter_value DUT pf6_bar4_present_hwtcl 0
set_instance_parameter_value DUT pf6_bar4_size_hwtcl 12
set_instance_parameter_value DUT pf6_bar4_type_hwtcl 1
set_instance_parameter_value DUT pf6_bar5_prefetchable_hwtcl 1
set_instance_parameter_value DUT pf6_bar5_present_hwtcl 0
set_instance_parameter_value DUT pf6_bar5_size_hwtcl 12
set_instance_parameter_value DUT pf6_class_code_hwtcl 0
set_instance_parameter_value DUT pf6_device_id_hwtcl 0
set_instance_parameter_value DUT pf6_exprom_bar_present_hwtcl 0
set_instance_parameter_value DUT pf6_exprom_bar_size_hwtcl 12
set_instance_parameter_value DUT pf6_interrupt_pin_hwtcl inta
set_instance_parameter_value DUT pf6_intr_line_hwtcl 0
set_instance_parameter_value DUT pf6_msi_multi_message_capable_hwtcl 4
set_instance_parameter_value DUT pf6_msix_pba_bir_hwtcl 0
set_instance_parameter_value DUT pf6_msix_pba_offset_hwtcl 0
set_instance_parameter_value DUT pf6_msix_table_bir_hwtcl 0
set_instance_parameter_value DUT pf6_msix_table_offset_hwtcl 0
set_instance_parameter_value DUT pf6_msix_table_size_hwtcl 0
set_instance_parameter_value DUT pf6_pci_prog_intfc_byte_hwtcl 0
set_instance_parameter_value DUT pf6_revision_id_hwtcl 0
set_instance_parameter_value DUT pf6_subclass_code_hwtcl 0
set_instance_parameter_value DUT pf6_subsystem_device_id_hwtcl 0
set_instance_parameter_value DUT pf6_subsystem_vendor_id_hwtcl 0
set_instance_parameter_value DUT pf6_vendor_id_hwtcl 0
set_instance_parameter_value DUT pf6_vf_device_id_hwtcl 0
set_instance_parameter_value DUT pf6_virtio_capability_present_hwtcl 0
set_instance_parameter_value DUT pf6_virtio_cmn_config_bar_indicator_hwtcl 0
set_instance_parameter_value DUT pf6_virtio_cmn_config_bar_offset_hwtcl 0
set_instance_parameter_value DUT pf6_virtio_cmn_config_structure_length_hwtcl 0
set_instance_parameter_value DUT pf6_virtio_device_specific_cap_present_hwtcl 0
set_instance_parameter_value DUT pf6_virtio_devspecific_bar_indicator_hwtcl 0
set_instance_parameter_value DUT pf6_virtio_devspecific_bar_offset_hwtcl 0
set_instance_parameter_value DUT pf6_virtio_devspecific_structure_length_hwtcl 0
set_instance_parameter_value DUT pf6_virtio_isrstatus_bar_indicator_hwtcl 0
set_instance_parameter_value DUT pf6_virtio_isrstatus_bar_offset_hwtcl 0
set_instance_parameter_value DUT pf6_virtio_isrstatus_structure_length_hwtcl 0
set_instance_parameter_value DUT pf6_virtio_notification_bar_indicator_hwtcl 0
set_instance_parameter_value DUT pf6_virtio_notification_bar_offset_hwtcl 0
set_instance_parameter_value DUT pf6_virtio_notification_structure_length_hwtcl 0
set_instance_parameter_value DUT pf6_virtio_notify_off_multiplier_hwtcl 0
set_instance_parameter_value DUT pf6_virtio_pciconfig_access_bar_indicator_hwtcl 0
set_instance_parameter_value DUT pf6_virtio_pciconfig_access_bar_offset_hwtcl 0
set_instance_parameter_value DUT pf6_virtio_pciconfig_access_structure_length_hwtcl 0
set_instance_parameter_value DUT pf7_bar0_prefetchable_hwtcl 1
set_instance_parameter_value DUT pf7_bar0_present_hwtcl 0
set_instance_parameter_value DUT pf7_bar0_size_hwtcl 12
set_instance_parameter_value DUT pf7_bar0_type_hwtcl 1
set_instance_parameter_value DUT pf7_bar1_prefetchable_hwtcl 1
set_instance_parameter_value DUT pf7_bar1_present_hwtcl 0
set_instance_parameter_value DUT pf7_bar1_size_hwtcl 12
set_instance_parameter_value DUT pf7_bar2_prefetchable_hwtcl 1
set_instance_parameter_value DUT pf7_bar2_present_hwtcl 0
set_instance_parameter_value DUT pf7_bar2_size_hwtcl 12
set_instance_parameter_value DUT pf7_bar2_type_hwtcl 1
set_instance_parameter_value DUT pf7_bar3_prefetchable_hwtcl 1
set_instance_parameter_value DUT pf7_bar3_present_hwtcl 0
set_instance_parameter_value DUT pf7_bar3_size_hwtcl 12
set_instance_parameter_value DUT pf7_bar4_prefetchable_hwtcl 1
set_instance_parameter_value DUT pf7_bar4_present_hwtcl 0
set_instance_parameter_value DUT pf7_bar4_size_hwtcl 12
set_instance_parameter_value DUT pf7_bar4_type_hwtcl 1
set_instance_parameter_value DUT pf7_bar5_prefetchable_hwtcl 1
set_instance_parameter_value DUT pf7_bar5_present_hwtcl 0
set_instance_parameter_value DUT pf7_bar5_size_hwtcl 12
set_instance_parameter_value DUT pf7_class_code_hwtcl 0
set_instance_parameter_value DUT pf7_device_id_hwtcl 0
set_instance_parameter_value DUT pf7_exprom_bar_present_hwtcl 0
set_instance_parameter_value DUT pf7_exprom_bar_size_hwtcl 12
set_instance_parameter_value DUT pf7_interrupt_pin_hwtcl inta
set_instance_parameter_value DUT pf7_intr_line_hwtcl 0
set_instance_parameter_value DUT pf7_msi_multi_message_capable_hwtcl 4
set_instance_parameter_value DUT pf7_msix_pba_bir_hwtcl 0
set_instance_parameter_value DUT pf7_msix_pba_offset_hwtcl 0
set_instance_parameter_value DUT pf7_msix_table_bir_hwtcl 0
set_instance_parameter_value DUT pf7_msix_table_offset_hwtcl 0
set_instance_parameter_value DUT pf7_msix_table_size_hwtcl 0
set_instance_parameter_value DUT pf7_pci_prog_intfc_byte_hwtcl 0
set_instance_parameter_value DUT pf7_revision_id_hwtcl 0
set_instance_parameter_value DUT pf7_subclass_code_hwtcl 0
set_instance_parameter_value DUT pf7_subsystem_device_id_hwtcl 0
set_instance_parameter_value DUT pf7_subsystem_vendor_id_hwtcl 0
set_instance_parameter_value DUT pf7_vendor_id_hwtcl 0
set_instance_parameter_value DUT pf7_vf_device_id_hwtcl 0
set_instance_parameter_value DUT pf7_virtio_capability_present_hwtcl 0
set_instance_parameter_value DUT pf7_virtio_cmn_config_bar_indicator_hwtcl 0
set_instance_parameter_value DUT pf7_virtio_cmn_config_bar_offset_hwtcl 0
set_instance_parameter_value DUT pf7_virtio_cmn_config_structure_length_hwtcl 0
set_instance_parameter_value DUT pf7_virtio_device_specific_cap_present_hwtcl 0
set_instance_parameter_value DUT pf7_virtio_devspecific_bar_indicator_hwtcl 0
set_instance_parameter_value DUT pf7_virtio_devspecific_bar_offset_hwtcl 0
set_instance_parameter_value DUT pf7_virtio_devspecific_structure_length_hwtcl 0
set_instance_parameter_value DUT pf7_virtio_isrstatus_bar_indicator_hwtcl 0
set_instance_parameter_value DUT pf7_virtio_isrstatus_bar_offset_hwtcl 0
set_instance_parameter_value DUT pf7_virtio_isrstatus_structure_length_hwtcl 0
set_instance_parameter_value DUT pf7_virtio_notification_bar_indicator_hwtcl 0
set_instance_parameter_value DUT pf7_virtio_notification_bar_offset_hwtcl 0
set_instance_parameter_value DUT pf7_virtio_notification_structure_length_hwtcl 0
set_instance_parameter_value DUT pf7_virtio_notify_off_multiplier_hwtcl 0
set_instance_parameter_value DUT pf7_virtio_pciconfig_access_bar_indicator_hwtcl 0
set_instance_parameter_value DUT pf7_virtio_pciconfig_access_bar_offset_hwtcl 0
set_instance_parameter_value DUT pf7_virtio_pciconfig_access_structure_length_hwtcl 0
set_instance_parameter_value DUT pf_ats_support_hwtcl 0
set_instance_parameter_value DUT pf_enable_function_msix_support_hwtcl 0
set_instance_parameter_value DUT pf_msi_support_hwtcl 0
set_instance_parameter_value DUT pf_tph_support_hwtcl 0
set_instance_parameter_value DUT port_type_hwtcl {Root port}
set_instance_parameter_value DUT reserved_debug_hwtcl 0
set_instance_parameter_value DUT revision_id_hwtcl 0
set_instance_parameter_value DUT rx_buffer_credit_alloc_hwtcl Low
set_instance_parameter_value DUT rx_cred_ctl_param_hwtcl 0
set_instance_parameter_value DUT rx_polinv_soft_logic_enable 0
set_instance_parameter_value DUT select_design_example_hwtcl PIO
set_instance_parameter_value DUT select_design_example_rtl_lang_hwtcl Verilog
set_instance_parameter_value DUT slave_address_map_0_hwtcl 12
set_instance_parameter_value DUT slave_address_map_1_hwtcl 4
set_instance_parameter_value DUT slave_address_map_2_hprxm_hwtcl 4
set_instance_parameter_value DUT slave_address_map_2_hwtcl 4
set_instance_parameter_value DUT slave_address_map_3_hwtcl 4
set_instance_parameter_value DUT slave_address_map_4_hwtcl 4
set_instance_parameter_value DUT slave_address_map_5_hwtcl 4
set_instance_parameter_value DUT slot_clock_cfg_hwtcl 1
set_instance_parameter_value DUT speed_change_hwtcl 0
set_instance_parameter_value DUT sr_iov_support_hwtcl 0
set_instance_parameter_value DUT sriov2_en 1
set_instance_parameter_value DUT subsystem_device_id_hwtcl 0
set_instance_parameter_value DUT subsystem_vendor_id_hwtcl 0
set_instance_parameter_value DUT system_page_sizes_supported_hwtcl 1363
set_instance_parameter_value DUT targeted_devkit_hwtcl {Arria 10 GX FPGA Development Kit}
set_instance_parameter_value DUT test_cseb_switch_hwtcl 0
set_instance_parameter_value DUT tlp_insp_trg_dw0_hwtcl 2049
set_instance_parameter_value DUT tlp_insp_trg_dw1_hwtcl 0
set_instance_parameter_value DUT tlp_insp_trg_dw2_hwtcl 0
set_instance_parameter_value DUT tlp_inspector_hwtcl 0
set_instance_parameter_value DUT tlp_inspector_use_signal_probe_hwtcl 0
set_instance_parameter_value DUT tlp_inspector_use_thin_rx_master 0
set_instance_parameter_value DUT total_pf_count_hwtcl 1
set_instance_parameter_value DUT use_dynamic_design_example_hwtcl 1
set_instance_parameter_value DUT use_rpbfm_pro 0
set_instance_parameter_value DUT user_id_hwtcl 0
set_instance_parameter_value DUT user_txs_addr_width_hwtcl 22
set_instance_parameter_value DUT vendor_id_hwtcl 4466
set_instance_parameter_value DUT vf_ats_support_hwtcl 0
set_instance_parameter_value DUT vf_msix_cap_present_hwtcl 0
set_instance_parameter_value DUT vf_tph_support_hwtcl 0
set_instance_parameter_value DUT virtio_visible 0
set_instance_parameter_value DUT vsec_cap_hwtcl 0
set_instance_parameter_value DUT vsec_id_hwtcl 4466
set_instance_parameter_value DUT wrala_hwtcl 5
set_instance_parameter_value DUT xcvr_reconfig_hwtcl 0
